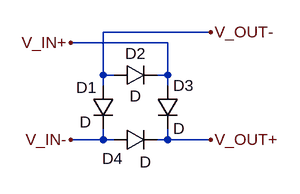
[diagram p0: schematic puente.asc]
puente.asc, the LTspice schematic file:
Version 4
SHEET 1 880 680
WIRE 256 16 96 16
WIRE 192 32 48 32
WIRE 96 80 96 16
WIRE 112 80 96 80
WIRE 192 80 192 32
WIRE 192 80 176 80
WIRE 96 96 96 80
WIRE 192 96 192 80
WIRE 96 176 96 160
WIRE 96 176 48 176
WIRE 112 176 96 176
WIRE 192 176 192 160
WIRE 192 176 176 176
WIRE 256 176 192 176
FLAG 48 32 V_IN+
FLAG 48 176 V_IN-
FLAG 256 176 V_OUT+
FLAG 256 16 V_OUT-
SYMBOL diode 112 96 R270
WINDOW 0 32 32 VTop 2
WINDOW 3 0 32 VBottom 2
SYMATTR InstName D2
SYMBOL diode 176 96 R0
SYMATTR InstName D3
SYMBOL diode 112 192 R270
WINDOW 0 -28 -2 VTop 2
WINDOW 3 -2 47 VBottom 2
SYMATTR InstName D4
SYMBOL diode 80 96 R0
WINDOW 0 -24 3 Left 2
WINDOW 3 -19 54 Left 2
SYMATTR InstName D1

The netlist it stands for:
* puente.asc
D2 V_OUT- V_IN+ D
D3 V_IN+ V_OUT+ D
D4 V_IN- V_OUT+ D
D1 V_OUT- V_IN- D
.model D D
.lib standard.dio
.backanno
.end